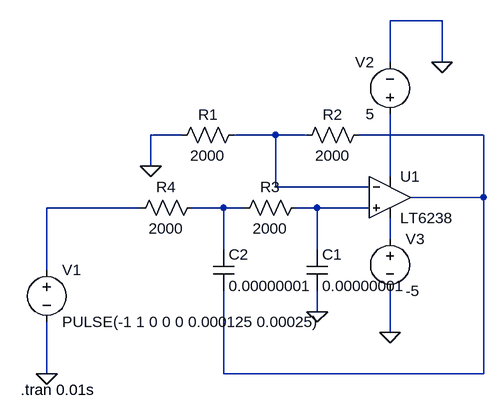
[diagram p0: schematic 2ndOrderButterworth.asc]
2ndOrderButterworth.asc, the LTspice schematic file:
Version 4
SHEET 1 936 680
WIRE 864 -176 784 -176
WIRE 784 -112 784 -176
WIRE 864 -112 864 -176
WIRE 464 0 416 0
WIRE 608 0 544 0
WIRE 656 0 608 0
WIRE 928 0 736 0
WIRE 416 48 416 0
WIRE 784 64 784 -32
WIRE 608 80 608 0
WIRE 752 80 608 80
WIRE 928 96 928 0
WIRE 928 96 816 96
WIRE 400 112 256 112
WIRE 528 112 480 112
WIRE 560 112 528 112
WIRE 672 112 640 112
WIRE 752 112 672 112
WIRE 784 160 784 128
WIRE 528 176 528 112
WIRE 672 176 672 112
WIRE 256 208 256 112
WIRE 672 272 672 240
WIRE 784 304 784 240
WIRE 256 368 256 288
WIRE 528 368 528 240
WIRE 928 368 928 96
WIRE 928 368 528 368
FLAG 416 48 0
FLAG 672 272 0
FLAG 784 304 0
FLAG 256 368 0
FLAG 864 -112 0
SYMBOL res 560 -16 R90
WINDOW 0 0 56 VBottom 2
WINDOW 3 32 56 VTop 2
SYMATTR InstName R1
SYMATTR Value 2000
SYMBOL res 752 -16 R90
WINDOW 0 0 56 VBottom 2
WINDOW 3 32 56 VTop 2
SYMATTR InstName R2
SYMATTR Value 2000
SYMBOL cap 656 176 R0
SYMATTR InstName C1
SYMATTR Value 0.00000001
SYMBOL cap 512 176 R0
SYMATTR InstName C2
SYMATTR Value 0.00000001
SYMBOL res 656 96 R90
WINDOW 0 0 56 VBottom 2
WINDOW 3 32 56 VTop 2
SYMATTR InstName R3
SYMATTR Value 2000
SYMBOL res 496 96 R90
WINDOW 0 0 56 VBottom 2
WINDOW 3 32 56 VTop 2
SYMATTR InstName R4
SYMATTR Value 2000
SYMBOL voltage 256 192 R0
WINDOW 123 0 0 Left 0
WINDOW 39 0 0 Left 0
SYMATTR InstName V1
SYMATTR Value PULSE(-1 1 0 0 0 0.000125 0.00025)
SYMBOL voltage 784 144 R0
SYMATTR InstName V3
SYMATTR Value -5
SYMBOL OpAmps\\LT6238 784 96 R0
SYMATTR InstName U1
SYMBOL voltage 784 -16 R180
WINDOW 0 24 96 Left 2
WINDOW 3 24 16 Left 2
SYMATTR InstName V2
SYMATTR Value 5
TEXT 216 392 Left 2 !.tran 0.01s

The netlist it stands for:
* 2ndOrderButterworth.asc
R1 N001 0 2000
R2 N002 N001 2000
C1 N006 0 0.00000001
C2 N005 N002 0.00000001
R3 N006 N005 2000
R4 N005 N004 2000
V1 N004 0 PULSE(-1 1 0 0 0 0.000125 0.00025)
V3 N007 0 -5
* U1: LT6238 (symbol OpAmps\LT6238 not available, pins judged from their places): In+=N006 In-=N001 V+=N003 V-=N007 OUT=N002
V2 N003 0 5
.tran 0.01s
.backanno
.end